# EasyEDA schematic 1-Schematic_esp_usb.json
TITLE: Sheet_1; REV: 1.0; Date: 2022-08-30; Sheet: 1/1; Drawn By: elanworld; Company: Your Company
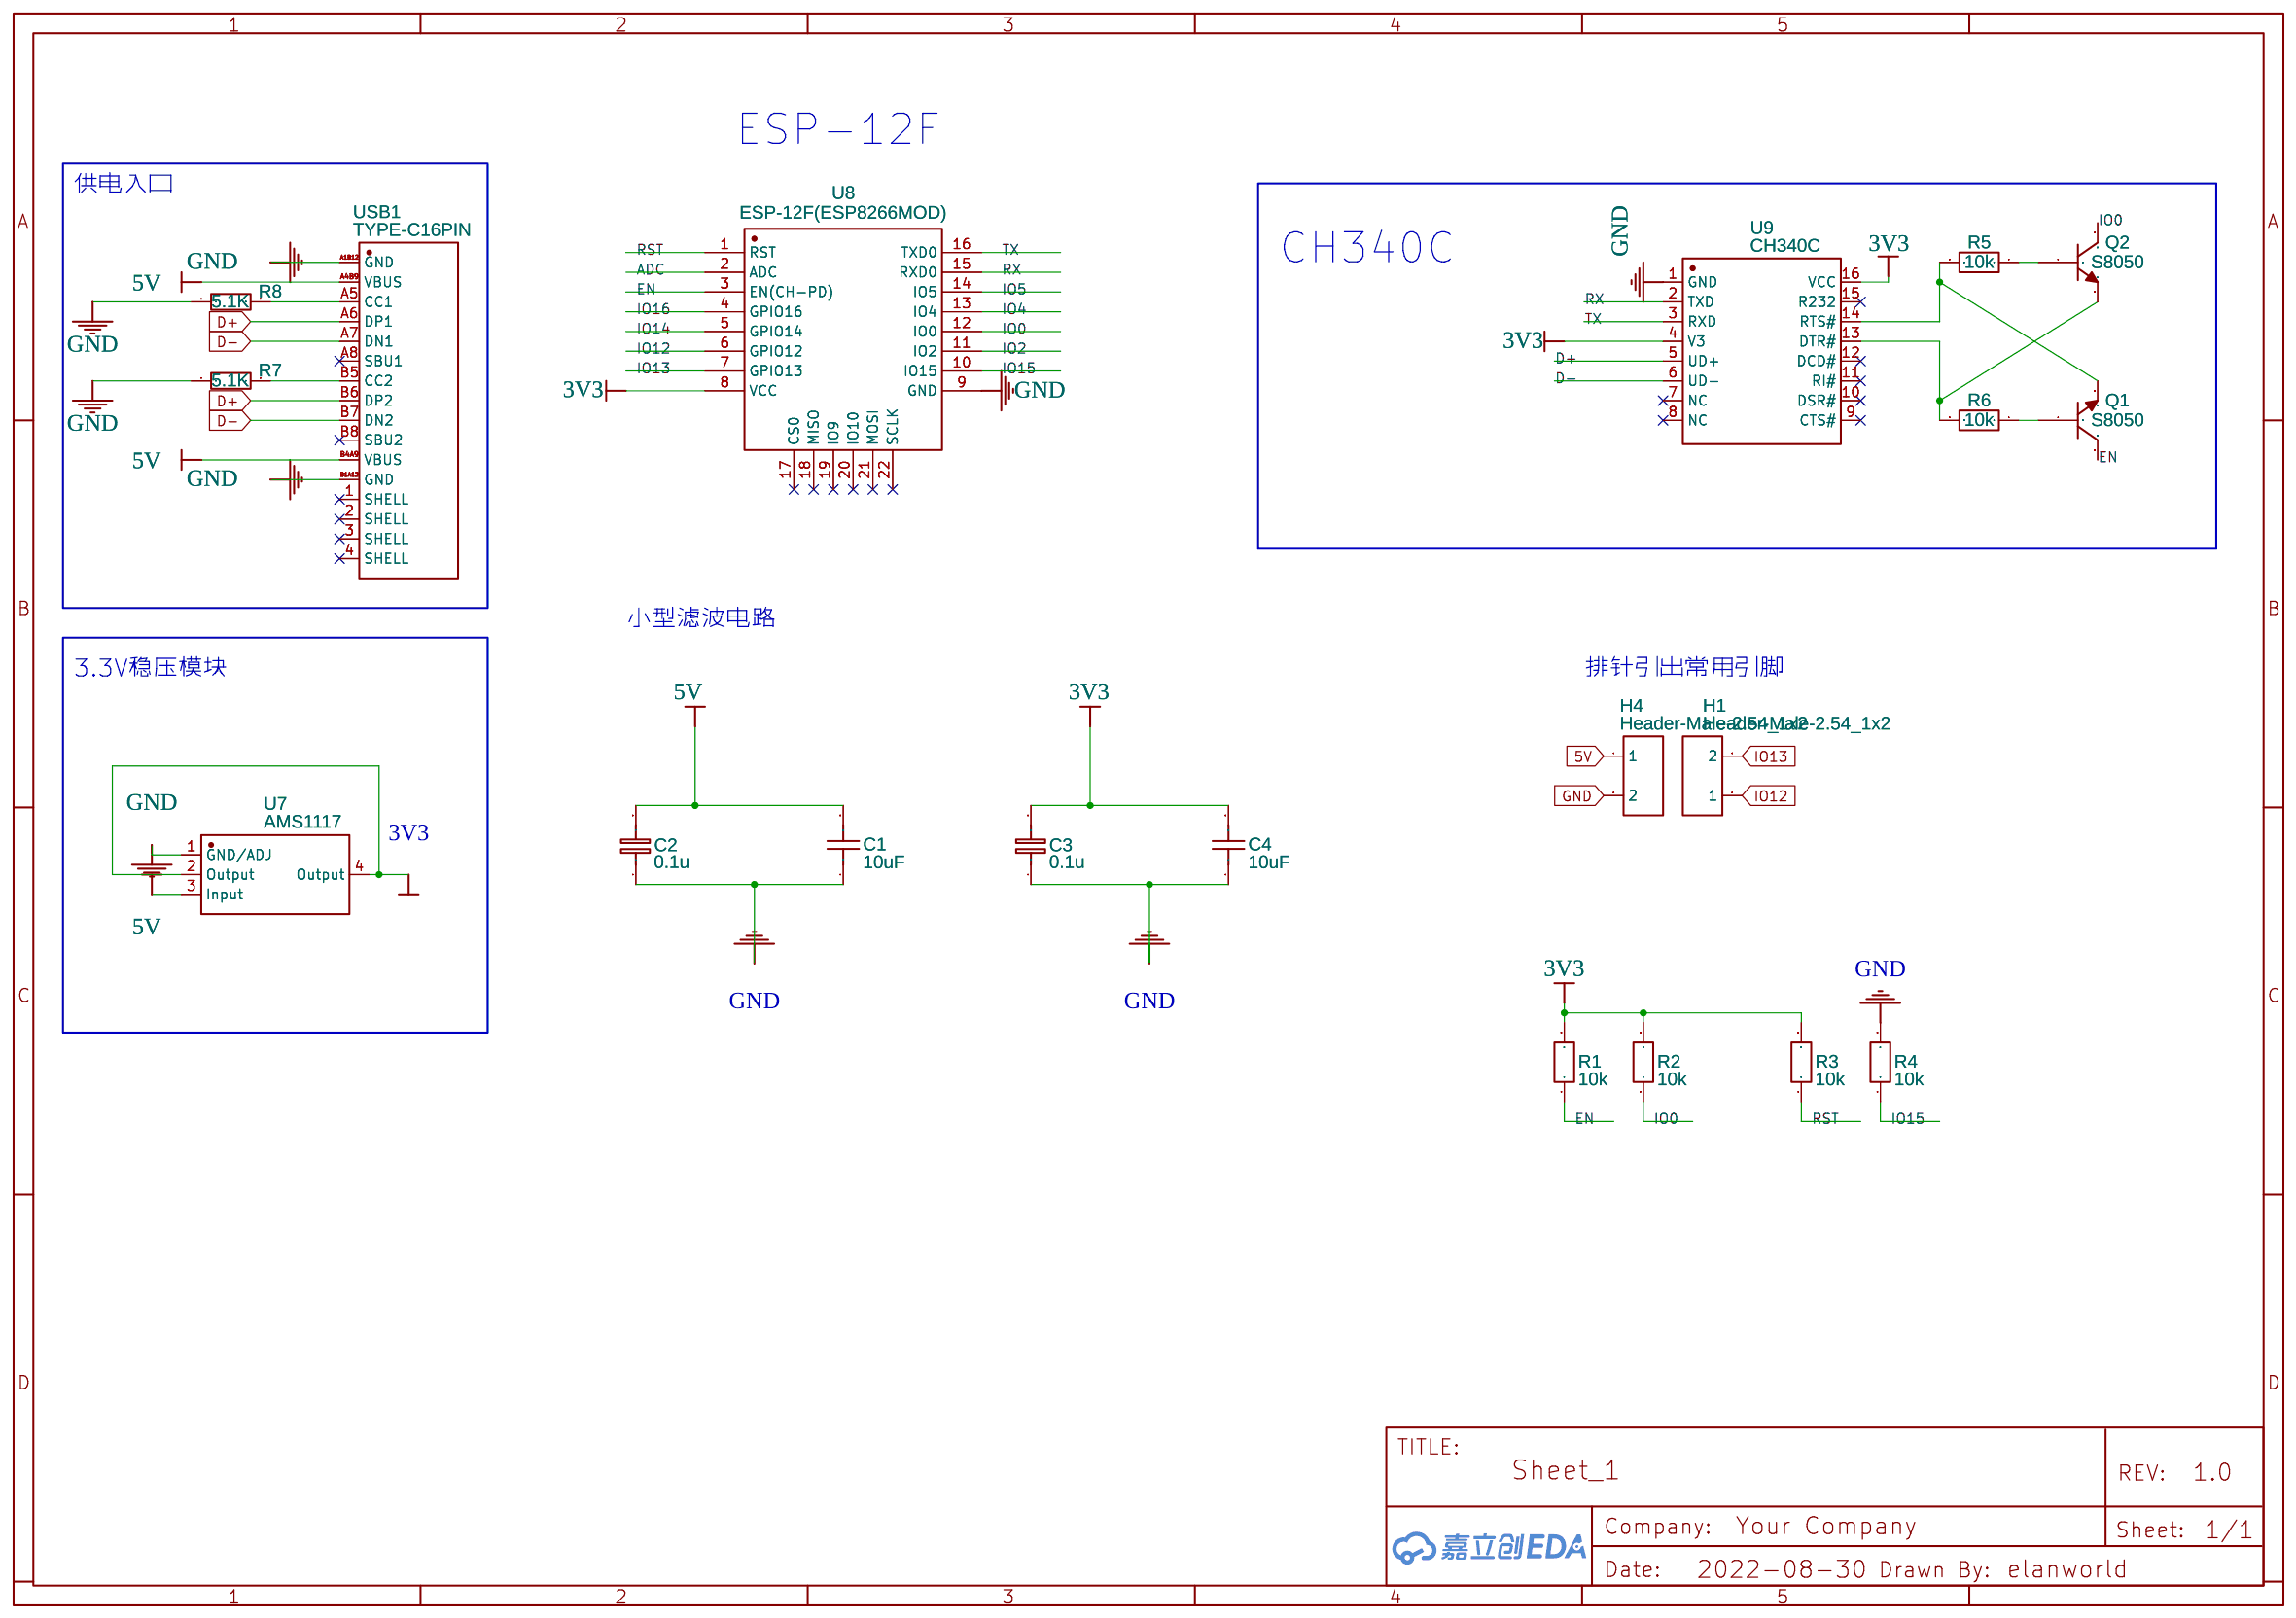
[diagram p0: schematic sheet]

## Parts
C1  10uF  [C0603]
C2  0.1u  [C0603]
C3  0.1u  [C0603]
C4  10uF  [C0603]
H1  Header-Male-2.54_1x2  [HDR-TH_2P-P2.54-V-M-1]
H4  Header-Male-2.54_1x2  [HDR-TH_2P-P2.54-V-M-1]
Q1  S8050  [SOT-23(SOT-23-3)]
Q2  S8050  [SOT-23(SOT-23-3)]
R1  10k  [R0603]
R2  10k  [R0603]
R3  10k  [R0603]
R4  10k  [R0603]
R5  10k  [R0603]
R6  10k  [R0603]
R7  5.1K  [R0402]
R8  5.1K  [R0402]
U7  AMS1117  [SOT-223-4_L6.5-W3.5-P2.30-LS7.0-BR]
U8  ESP-12F(ESP8266MOD)  [WIFIM-SMD_ESP-12F-ESP8266MOD]
U9  CH340C  [SOP-16_150MIL]
USB1  TYPE-C16PIN  [USB-C-SMD_TYPE-C16PIN]

## Library data of the parts
C1 C4 = CL10A106MP8NNNC: Supplier: LCSC; Manufacturer: SAMSUNG; Supplier Part: C85713; JLCPCB Part Class: Extended Part
C2 C3 = C_0603_EU: Supplier Part: C1591; Contributor: LCEDA_Lib
H1 H4 = Header-Male-2.54_1x2: Supplier: LCSC; Manufacturer: TE Connectivity; Manufacturer Part: 826629-2; Supplier Part: C86471; JLCPCB Part Class: Extended Part
Q1 Q2 = -: Supplier: LCSC; Manufacturer: Yenji; Contributor: LCSC; Supplier Part: C364312; LCSC Assembly: Yes; SMT Type: Extend
R1-R4 = R_0603_EU: Supplier Part: C169103; Contributor: LCEDA_Lib
R5 R6 = Res_0603(1/10W)_EU: Supplier: LCSC; Supplier Part: C169103
R7 R8 = RMC04025.1K1%N: Supplier: LCSC; Supplier Part: C325521; Manufacturer: Tyohm; Contributor: LCSC
U7 = AMS1117-3.3_C369933: Supplier: LCSC; Supplier Part: C369933; Manufacturer: KEXIN; Manufacturer Part: AMS1117-3.3; Contributor: LCSC; JLCPCB Part Class: Extended Part
U8 = ESP-12F(ESP8266MOD): Supplier: LCSC; Manufacturer: Ai-Thinker; Supplier Part: C82891; JLCPCB Part Class: Extended Part
U9 = -: Supplier: LCSC; Manufacturer: WCH; Supplier Part: C84681
USB1 = TYPE-C16PIN: Supplier: LCSC; Supplier Part: C393939; Manufacturer: SHOU HAN; Contributor: LCSC; JLCPCB Part Class: Extended Part

## Nets
3V3: C3.2 C4.2 R1.2 R2.2 R3.2 U7.2(Output) U7.4(Output) U8.8(VCC) U9.4(V3) U9.16(VCC)
5V: C1.2 C2.2 H4.1 U7.3(Input) USB1.A4B9(VBUS) USB1.B4A9(VBUS)
GND: C1.1 C2.1 C3.1 C4.1 H4.2 R4.2 R7.1 R8.1 U7.1(GND/ADJ) U8.9(GND) U9.1(GND) USB1.A1B12(GND) USB1.B1A12(GND)
ADC: U8.2(ADC)
D+: U9.5(UD+) USB1.A6(DP1) USB1.B6(DP2)
D-: U9.6(UD-) USB1.A7(DN1) USB1.B7(DN2)
EN: Q1.3(C) R1.1 U8.3(EN(CH-PD))
IO0: Q2.3(C) R2.1 U8.12(IO0)
IO2: U8.11(IO2)
IO4: U8.13(IO4)
IO5: U8.14(IO5)
IO12: H1.1 U8.6(GPIO12)
IO13: H1.2 U8.7(GPIO13)
IO14: U8.5(GPIO14)
IO15: R4.1 U8.10(IO15)
IO16: U8.4(GPIO16)
RST: R3.1 U8.1(RST)
RX: U8.15(RXD0) U9.2(TXD)
TX: U8.16(TXD0) U9.3(RXD)
Net-(Q1-1): Q1.1(B) R6.1
Net-(Q1-2): Q1.2(E) R5.2 U9.14(RTS#)
Net-(Q2-1): Q2.1(B) R5.1
Net-(Q2-2): Q2.2(E) R6.2 U9.13(DTR#)
Net-(R7-2): R7.2 USB1.B5(CC2)
Net-(R8-2): R8.2 USB1.A5(CC1)

Not connected (* = marked no-connect by the designer): U8 17(CS0)* 18(MISO)* 19(IO9)* 20(IO10)* 21(MOSI)* 22(SCLK)*; U9 7(NC)* 8(NC)* 9(CTS#)* 10(DSR#)* 11(RI#)* 12(DCD#)* 15(R232)*; USB1 1(SHELL)* 2(SHELL)* 3(SHELL)* 4(SHELL)* A8(SBU1)* B8(SBU2)*

## Notes on the sheet
- ESP-12F
- 供电入口
- CH340C
- 小型滤波电路
- 3.3V稳压模块
- 排针引出常用引脚
